# EAGLE schematic FL-Ver0.6 (EAGLE 6.3)
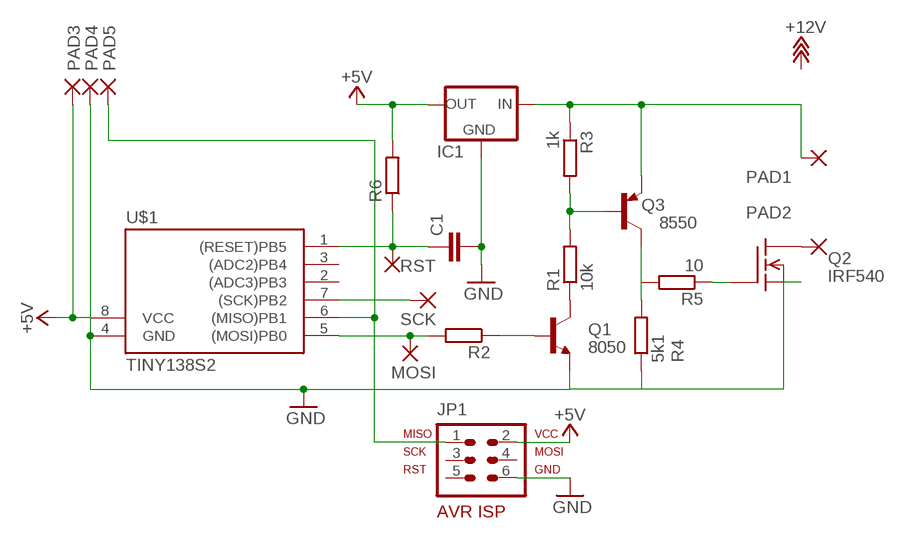
[diagram p0: schematic, sheet 1]

## Parts
C1  C-EUC0805  [C0805]
IC1  78MXXSDPACK  [DPACK]
JP1  AVR-ISP-6VERT  [AVR-ISP-6]
MOSI  1,6/0,8  [1,6/0,8]
PAD1  SMD5  [SMD2,54-5,08]
PAD2  SMD5  [SMD2,54-5,08]
PAD3  SMD5  [SMD2,54-5,08]
PAD4  SMD5  [SMD2,54-5,08]
PAD5  SMD5  [SMD2,54-5,08]
Q1  8050  -NPN-TO92-EBC  [TO92-EBC]
Q2  IRF540  [TO220]
Q3  8550  BC327-16-PNP-TO92-EBC  [TO92-EBC]
R1  10k  R-EU_0309/12  [0309/12]
R2  R-EU_0309/12  [0309/12]
R3  1k  R-EU_0309/12  [0309/12]
R4  5k1  R-EU_0309/12  [0309/12]
R5  10  R-EU_0309/12  [0309/12]
R6  R-EU_M0805  [M0805]
RST  1,6/0,8  [1,6/0,8]
SCK  1,6/0,8  [1,6/0,8]
U$1  TINY138S2  [SO08]

## Nets
+5V: IC1.3(OUT) JP1.2 PAD3.1(P) R6.2 U$1.8(VCC)
GND: C1.2 IC1.2(GND) JP1.6 PAD4.1(P) Q1.E Q2.3(S) R4.1 U$1.4(GND)
N$1: Q2.1(G) R5.1
N$2: SCK.1(P) U$1.7((SCK)PB2)
N$3: Q1.B R2.1
N$4: C1.1 R6.1 RST.1(P) U$1.1((RESET)PB5)
N$5: PAD2.1(P) Q2.2(D)
N$6: Q1.C R1.1
N$7: Q3.B R1.2 R3.2
N$8: Q3.C R4.2 R5.2
N$10: JP1.1 PAD5.1(P) U$1.6((MISO)PB1)
N$11: IC1.1(IN) PAD1.1(P) Q3.E R3.1
N$12: MOSI.1(P) R2.2 U$1.5((MOSI)PB0)
Unconnected: JP1.3 JP1.4 JP1.5 U$1.2((ADC3)PB3) U$1.3((ADC2)PB4)

## Library data of the parts
C1 = _myrc:C-EU: CAPACITOR, European symbol
IC1 = _mylbr:78MXXS: VOLTAGE REGULATOR
JP1 = _Atmel-avr-7:AVR-ISP-6: AVR ISP-6 Serial Programming Header
MOSI RST SCK = _wirepad:1,6/0,8: THROUGH-HOLE PAD
PAD1-PAD5 = _wirepad:SMD5: SMD PAD
Q1 = transistor:*-NPN-: NPN Transistror BF959 corrected 2008.03.06
Q2 = transistor-fet:IRF540: N-Channel Enhancement MOSFET (HEXFET); 100V; 28A; 0,077Ohm
Q3 = transistor:*-PNP-: PNP Transistror
R1-R6 = _myrc:R-EU_: RESISTOR, European symbol
U$1 = _Atmel-avr-7:TINY13*